# Altium schematic sheet PC104.SchDoc
size A; SheetNumber: 1; SheetTotal: 18
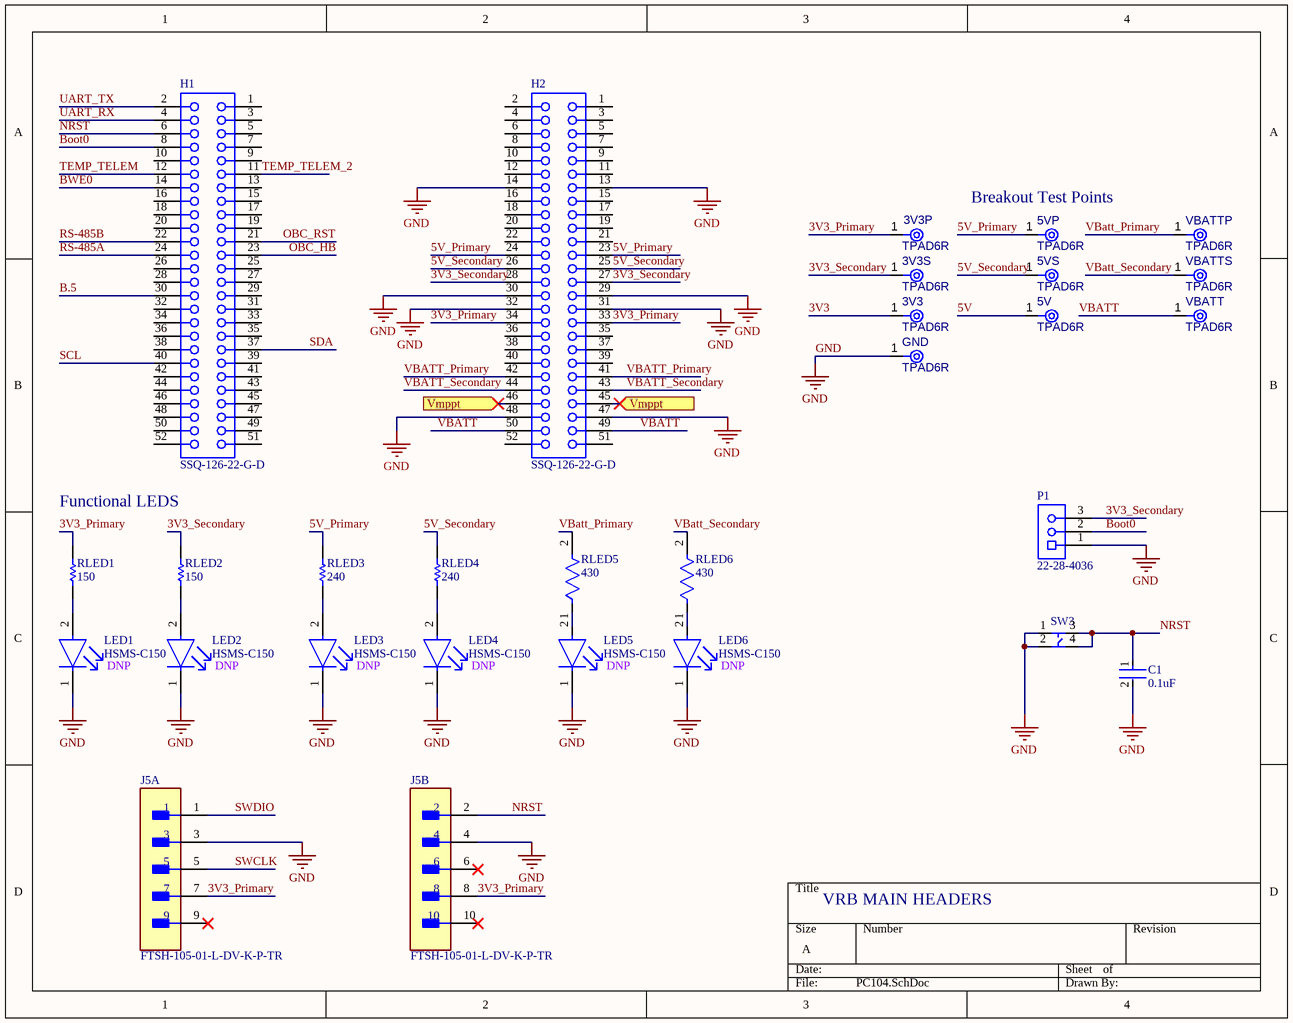
[diagram p0: PC104.SchDoc]

## Parts
3V3  TPAD6R  [TP06R]  (no BOM)
3V3P  TPAD6R  [TP06R]  (no BOM)
3V3S  TPAD6R  [TP06R]  (no BOM)
5V  TPAD6R  [TP06R]  (no BOM)
5VP  TPAD6R  [TP06R]  (no BOM)
5VS  TPAD6R  [TP06R]  (no BOM)
C1  0.1uF  [FP-C0603-CJ-MFG]
GND  TPAD6R  [TP06R]  (no BOM)
H1  SSQ-126-22-G-D  [SMTC-SSQ-126-22-X-D]
H2  SSQ-126-22-G-D  [SMTC-SSQ-126-22-X-D]
J5  FTSH-105-01-L-DV-K-P-TR  [FP-FTSH-105-01-L-DV-K-P-T-MFG]  (parts A,B of 2)
LED1  HSMS-C150  [FP-HSMS-C150-MFG]
LED2  HSMS-C150  [FP-HSMS-C150-MFG]
LED3  HSMS-C150  [FP-HSMS-C150-MFG]
LED4  HSMS-C150  [FP-HSMS-C150-MFG]
LED5  HSMS-C150  [FP-HSMS-C150-MFG]
LED6  HSMS-C150  [FP-HSMS-C150-MFG]
P1  22-28-4036  [22-28-4036-Footprint-1]
RLED1  150  [RESC1608X55X25ML10T15]
RLED2  150  [RESC1608X55X25ML10T15]
RLED3  240  [RESC1608X55X30NL20T20]
RLED4  240  [RESC1608X55X30NL20T20]
RLED5  430  [FP-CRCW0603-e3-IPC_B]
RLED6  430  [FP-CRCW0603-e3-IPC_B]
SW3  TS04-66-43-BK-100-SMT  [SOP127P600-8N]  (value not drawn)
VBATT  TPAD6R  [TP06R]  (no BOM)
VBATTP  TPAD6R  [TP06R]  (no BOM)
VBATTS  TPAD6R  [TP06R]  (no BOM)

## Ports
Vmppt (in)

## Nets
GND: C1.2 GND.1(TP) H2.13 H2.14 H2.29 H2.30 H2.31 H2.32 H2.47 H2.48 J5.3 J5.4 LED1.1(C) LED2.1(C) LED3.1(C) LED4.1(C) LED5.1(C) LED6.1(C) P1.1 SW3.1 SW3.2
3V3: 3V3.1(TP)
3V3_Primary: 3V3P.1(TP) H2.33 H2.34 J5.7 J5.8 RLED1.2
3V3_Secondary: 3V3S.1(TP) H2.27 H2.28 P1.3 RLED2.2
5V: 5V.1(TP)
5V_Primary: 5VP.1(TP) H2.23 H2.24 RLED3.2
5V_Secondary: 5VS.1(TP) H2.25 H2.26 RLED4.2
B.5: H1.30
Boot0: H1.8 P1.2
BWE0: H1.14
NRST: C1.1 H1.6 J5.2 SW3.3 SW3.4
OBC_HB: H1.23
OBC_RST: H1.21
RS-485A: H1.24
RS-485B: H1.22
SCL: H1.40
SDA: H1.37
SWCLK: J5.5
SWDIO: J5.1
TEMP_TELEM: H1.12
TEMP_TELEM_2: H1.11
UART_RX: H1.4
UART_TX: H1.2
VBATT: H2.49 H2.50 VBATT.1(TP)
VBatt_Primary: H2.41 H2.42 RLED5.2 VBATTP.1(TP)
VBatt_Secondary: H2.43 H2.44 RLED6.2 VBATTS.1(TP)
Vmppt: H2.45 H2.46 ; port Vmppt
NetLED1_2: LED1.2(A) RLED1.1
NetLED2_2: LED2.2(A) RLED2.1
NetLED3_2: LED3.2(A) RLED3.1
NetLED4_2: LED4.2(A) RLED4.1
NetLED5_2: LED5.2(A) RLED5.1
NetLED6_2: LED6.2(A) RLED6.1

Not connected (* = marked no-connect by the designer): H1 1 3 5 7 9 10 13 15 16 17 18 19 20 25 26 27 28 29 31 32 33 34 35 36 38 39 41 42 43 44 45 46 47 48 49 50 51 52; H2 1 2 3 4 5 6 7 8 9 10 11 12 15 16 17 18 19 20 21 22 35 36 37 38 39 40 51 52; J5 6* 9* 10*

## Notes on the sheet
- (near 5VP) Breakout Test Points
- Functional LEDS
- (near LED1) DNP
- (near LED2) DNP
- (near LED3) DNP
- (near LED4) DNP
- (near LED5) DNP
- (near LED6) DNP
- VRB MAIN HEADERS

## Library data of the parts
3V3 3V3P 3V3S 5V 5VP 5VS GND VBATT VBATTP VBATTS = CMP-00028-00002-2: 0.6mm round; Pins: 1
C1 = CMP-2006-03300-2: CAP CER 0.1UF 50V X7R 0603 / C0603X104K5RACTU; Manufacturer: Kemet; Capacitance: 100nF; Material: Ceramic; Tolerance: 10%; Value: 100nF; Temperature Coefficient: 15%; Temperature Range High: +125°C; Temperature Range Low: -55°C; Manufacturer Part Number: C0603X104K5RACTU; Voltage: 50V; ComponentLink2Description: Datasheet; RoHS: TRUE; ComponentLink2URL: https://content.kemet.com/datasheets/KEM_C1013_X7R_FT-CAP_SMD.pdf; Device Class L3: Ceramic Capacitors; Device Class L2: Capacitors; Package: C0603-CJ; Height: 0.95mm; Device Class L1: Passive Components; Temperature Characteristic: X7R; Lead Free: Yes; Digikey Description: CAP CER 0.1UF 50V X7R 0603; Automotive: No; Mouser Description: Capacitor; Ceramic; Cap 0.1uF; Tol+10%; SMT; Flexible Termination; Vol-Rtg 50V; TR; Temperature: -55°C to +125°C; Octopart: https://octopart.com/c0603x104k5ractu-kemet-9145062; Category: Cap; Voltage Rating: 50V; Ipc Land Pattern Name: CAPC16080X80
H1 H2 = CMP-1023-00317-1: SQ Post Socket, Through-hole, Vertical, -55 to 125 degC, 2.54 mm Pitch, 52-Pin, Female, RoHS; Manufacturer: Samtec; Pitch: 2.54 mm; ComponentLink1Description: Manufacturer URL; ComponentLink3Description: Package Specification; PackageVersion: BD, 6/1987; ComponentLink2URL: http://www.samtec.com/documents/webfiles/pdf/SSQ_TH.PDF; Temperature Range: -55 to 125 degC; PackageDescription: Assembly, Socket Strip .025[0.64] SQ Tail; Mounting Technology: Through-hole; ComponentLink3URL: http://www.samtec.com/documents/webfiles/cpdf/SSQ-1XX-XX-XXX-X-XX-XXX-XX-X-MKT.pdf; PartNumber: SSQ-126-22-G-D; ComponentLink2Description: Datasheet; ComponentLink1URL: http://www.samtec.com; DatasheetVersion: F-214; RoHS: True; Orientation: Vertical; PackageReference: SSQ-126-22-X-D
J5 = CMP-002-00076-1: Board Connector, 10 Contact(s), 2 Row(s), Male, Straight, 0.05 inch Pitch, Surface Mount Terminal, Locking; RoHS Compliant: Yes; Connector Type: BOARD CONNECTOR; Mounting Technology: Board
LED1-LED6 = CMP-21615-000001-1: LED RED DIFFUSED CHIP SMD; Luminous Intensity: 10mcd; Power Dissipation: 65mW; Viewing Angle: 170°; Number of Elements: 1; Forward Current: 20mA; Lens Color: White; Lens Style: Rectangular; Wavelength: 626nm; Forward Voltage: 2.1V; Reverse Voltage: 5V; Number of Pins: 2; Color: Red; Lead Free: Lead Free; Width: 1.6mm; Length: 3.2mm; REACH SVHC: No SVHC; Height: 1.1mm; Depth: 1.6mm; Power Rating: 65mW; Package Quantity: 1; Illumination Color: Red; Radiation Hardening: No; Case Code (Imperial): 1206; Max Operating Temperature: 85°C; Test Current: 20mA; Case/Package: 1206; Lens Transparency: Diffused; Number of LEDs: 1; Packaging: Tape and Reel; Mount: Surface Mount; Min Operating Temperature: -40°C; Case Code (Metric): 3216; Dominant Wavelength: 626nm
P1 = CMP-002-00073-2: KK 254 Breakaway Header, Vertical, 3 Circuits, 0.76µm Gold (Au) Selective Plating, Mating Pin Length 6.09mm; Voltage Rating: 250V; Gender: Male; Min Operating Temperature: 0°C; Mounting Technology: Through Hole; Pins: 3; Max Operating Temperature: 75°C
RLED1 RLED2 = CMP-1659-00057-1: Chip Resistor, 150 Ohm, +/- 1%, 0.1 W, -55 to 155 degC, 0603 (1608 Metric), RoHS, Tape and Reel / RC0603FR-07150RL; Viewing Angle: 20 degrees; Luminous Intensity: 200 mcd; Case\Package: Radial; Lens Style: Clear; Nominal Vf: 2.2 V; Illumination Colour: Green; PackageReference: 0603; PackageDescription: 2-Pin Surface Mount Device, Body 1.6 x 0.8 mm; Package Quantity: 1000; Packaging: Bulk; DatasheetVersion: Rev. 4, 02/2016; ComponentLink2URL: http://www.yageo.com/documents/recent/PYu-RC_Group_51_RoHS_L_04.pdf; ComponentLink1Description: Manufacturer URL; Height: 8.6 mm; ComponentLink2Description: Datasheet; Mount: Through Hole; Colour: Green; RoHSCompliant: true; ComponentLink1URL: http://www.yageo.com/; Forward Voltage: 2.2 V
RLED3 RLED4 = CMP-2000-00001-1: 240 Ohm 0603 / ERA3AEB244V; Manufacturer: Panasonic; Part Number: ERA3AEB244V
RLED5 RLED6 = CMP-1012-00468-3: RES Thick Film, 430Ω, 1%, 0.1W, 100ppm/°C, 0603 / CRCW0603430RFKEA; Power Rating: 100mW; Voltage Rating: 75V; Resistance: 430R; Radiation Hardening: No; Width: 0.033inch; Max Operating Temperature: 155°C; Height: 0.45mm; Temperature Coefficient: 100ppm/°C; Number of Terminations: 2; Package Quantity: 10; Composition: Thick Film; Mount: Surface Mount; Contact Plating: Tin; Tolerance: 1%; Voltage Rating (DC): 75V; Case/Package: 0603; Features: Automotive AEC-Q200; Case Code (Imperial): 0603; Depth: 0.85mm; Termination: SMD/SMT; Packaging: Tape and Reel; Min Operating Temperature: -55°C; Weight: 7.1E-05oz; Case Code (Metric): 1608; Number of Pins: 2; Military Standard: Not; Lead Free: Lead Free; Length: 1.55mm; Working Voltage: 75V; Max Power Dissipation: 100mW
SW3 = CMP-011-00014-3: Momentary Switch; Rated Voltage Max: 1 V; Rated Voltage Min: 12 V; Rated Current Max: 0.01 mA; Rated Current Min: 50 mA; DataSheet: https://www.cuidevices.com/product/resource/ts04.pdf